# EAGLE design main (EAGLE 9.4.2)
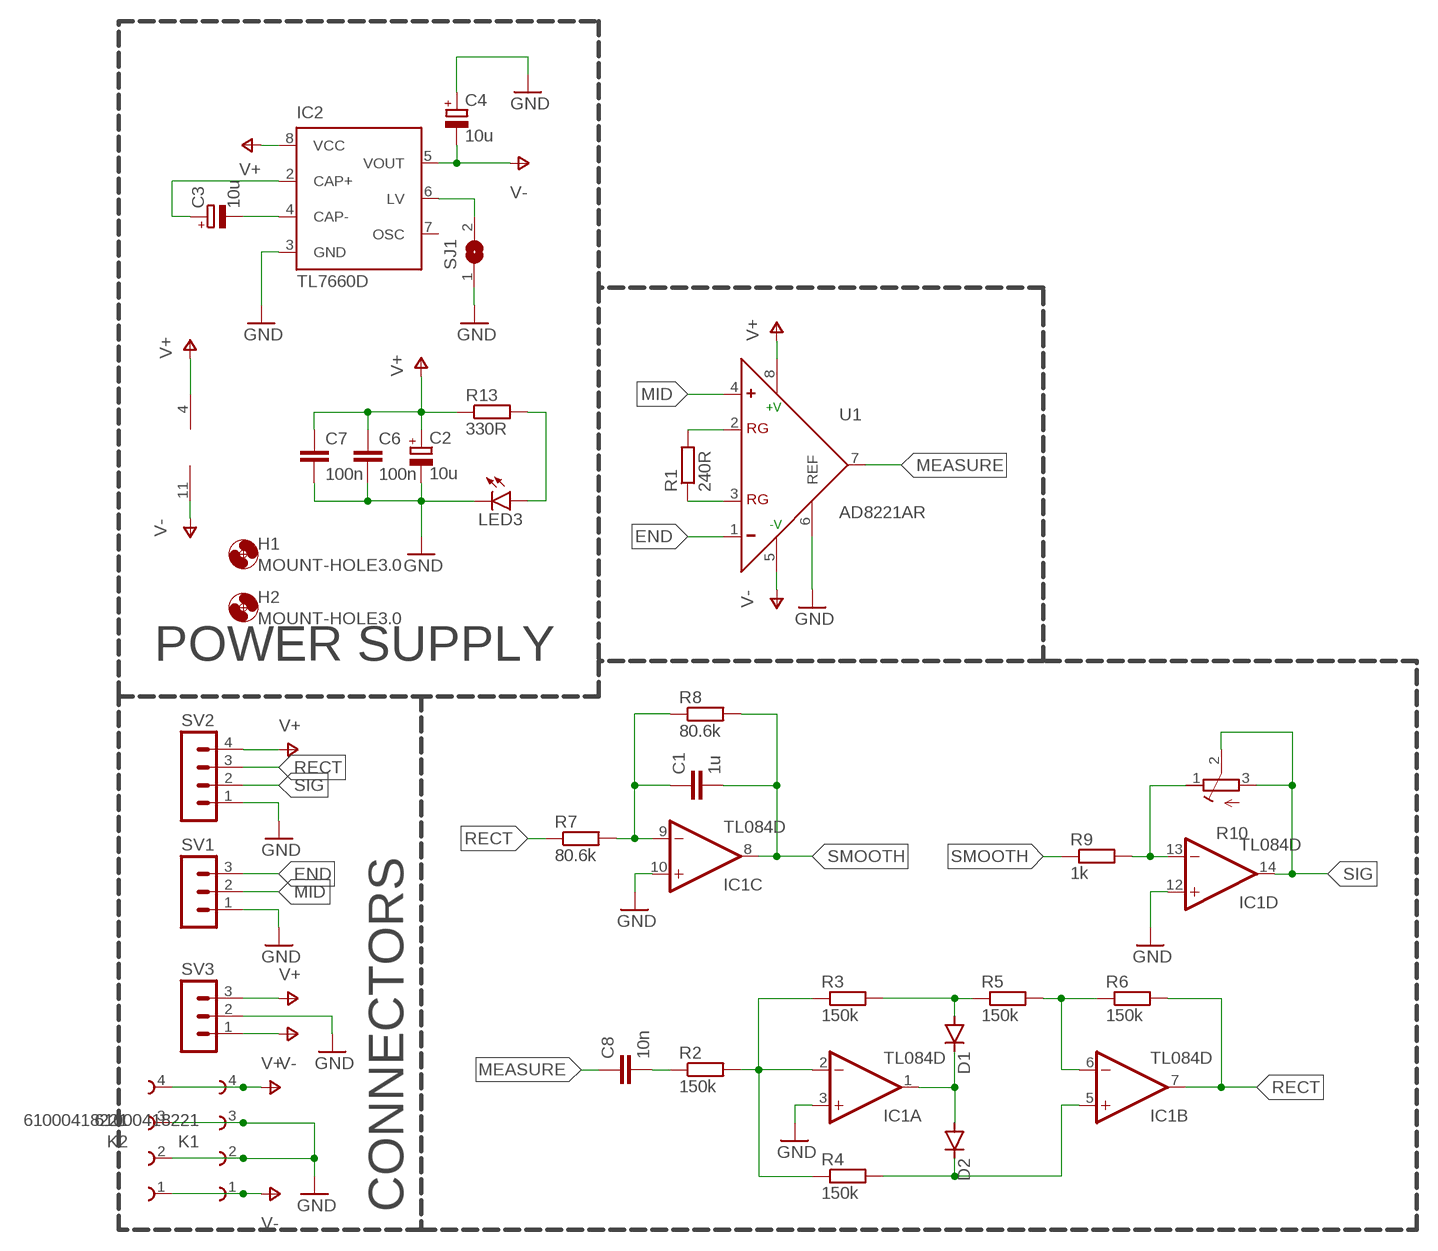
[diagram p0: schematic, sheet 1]

## Parts
C1  1u  C-EUC0805  [C0805]
C2  10u  CPOL-EUSMCB  [SMC_B]
C3  10u  CPOL-EUSMCB  [SMC_B]
C4  10u  CPOL-EUSMCB  [SMC_B]
C6  100n  C-EUC0805  [C0805]
C7  100n  C-EUC0805  [C0805]
C8  10n  C-EUC0805  [C0805]
D1  DIODE-SOD80C  [SOD80C]
D2  DIODE-SOD80C  [SOD80C]
H1  MOUNT-HOLE3.0  [3,0]
H2  MOUNT-HOLE3.0  [3,0]
IC1  TL084D  [SO14]
IC2  TL7660D  [D_R-PDSO-G08]
K1  61000418221  [61000418221]
K2  61000418221  [61000418221]
LED3  LEDCHIP-LED0805  [CHIP-LED0805]
R1  240R  R-EU_R1206  [R1206]
R2  150k  R-EU_R1206  [R1206]
R3  150k  R-EU_R1206  [R1206]
R4  150k  R-EU_R1206  [R1206]
R5  150k  R-EU_R1206  [R1206]
R6  150k  R-EU_R1206  [R1206]
R7  80.6k  R-EU_R1206  [R1206]
R8  80.6k  R-EU_R1206  [R1206]
R9  1k  R-EU_R1206  [R1206]
R10  R-TRIMM3314J  [RTRIM3314J]
R13  330R  R-EU_R1206  [R1206]
SJ1  SJ  [SJ]
SV1  MA03-1  [MA03-1]
SV2  MA04-1  [MA04-1]
SV3  MA03-1  [MA03-1]
U1  AD8221AR  [SO8]

## Nets
END: SV1.3 U1.1(-)
GND: C2.- C4.+ C6.2 C7.2 IC1.3(A:+IN) IC1.10(C:+IN) IC1.12(D:+IN) IC2.3(GND) K1.2 K1.3 K2.2 K2.3 LED3.C SJ1.1 SV1.1 SV2.1 SV3.2 U1.6(REF)
MEASURE: C8.1 U1.7(OUT)
MID: SV1.2 U1.4(+)
N$1: IC1.2(A:-IN) R2.2 R3.1 R4.1
N$2: C8.2 R2.1
N$3: D1.C D2.A IC1.1(A:OUT)
N$4: R1.2 U1.2(RG)
N$5: R1.1 U1.3(RG)
N$6: D1.A R3.2 R5.1
N$7: D2.C IC1.5(B:+IN) R4.2
N$8: IC1.6(B:-IN) R5.2 R6.1
N$9: C1.1 IC1.9(C:-IN) R7.2 R8.1
N$10: IC2.6(LV) SJ1.2
N$11: IC1.13(D:-IN) R9.2 R10.1(E)
N$13: C3.+ IC2.2(CAP+)
N$14: C3.- IC2.4(CAP-)
N$19: LED3.A R13.2
RECT: IC1.7(B:OUT) R6.2 R7.1 SV2.3
SIG: IC1.14(D:OUT) R10.2(S) R10.3(A) SV2.2
SMOOTH: C1.2 IC1.8(C:OUT) R8.2 R9.1
V+: C2.+ C6.1 C7.1 IC1.4(P:V+) IC2.8(VCC) K1.4 K2.4 R13.1 SV2.4 SV3.3 U1.8(+V)
V-: C4.- IC1.11(P:V-) IC2.5(VOUT) K1.1 K2.1 SV3.1 U1.5(-V)
Unconnected: IC2.7(OSC)

## Notes on the sheet
- POWER SUPPLY
- CONNECTORS

## Library data of the parts
C1 C6-C8 = rcl:C-EU: CAPACITOR, European symbol; SPICEPREFIX: C
C2-C4 = rcl:CPOL-EU: POLARIZED CAPACITOR, European symbol; SPICEPREFIX: C
D1 D2 = diode:DIODE-: DIODE
H1 H2 = holes:MOUNT-HOLE: MOUNTING HOLE with drill center marker
IC1 = linear:TL084: OP AMP
IC2 = texas:TL7660: CMOS VOLTAGE CONVERTER Source: http://focus.ti.com/lit/ds/scas794/scas794.pdf; MPN: TL7660CD; OC_FARNELL: 1755282; OC_NEWARK: 14M2439
K1 K2 = Wurth_Elektronik_Electromechanic_Board_to_Board_Connectors_rev15c:61000418221: WR-PHD 2.54mm SMT Pin Header, 4 Pins =>Code : Con_BTB_PHD_2.54_1_SMT_61000418221 <http://katalog.we-online.de/media/images/eican/Con_BTB_PHD_2.54_1_SMT_6100xx18221_pf2.jpg> Details see: http://katalog.we-online.de/en/em/610_0xx_182_21 Created 2014-05-29, Karrer Zheng 2014 (C) Würth Elektronik
LED3 = led:LED: LED OSRAM: - CHIPLED LG R971, LG N971, LY N971, LG Q971, LY Q971, LO R971, LY R971 LH N974, LH R974 LS Q976, LO Q976, LY Q976 LO Q996 - Hyper CHIPLED LW Q18S LB Q993, LB Q99A, LB R99A - SideLED LS A670, LO A670, LY A670, LG A670, LP A670 LB A673, LV A673, LT A673, LW A673 LH A674 LY A675 LS A676, LA A676, LO A676, LY A676, LW A676 LS A679, LY A679, LG A679 - Hyper Micro SIDELED® LS Y876, LA Y876, LO Y876, LY Y876 LT Y87S - SmartLED LW L88C, LW L88S LB L89C, LB L89S, LG L890 LS L89K, LO L89K, LY L89K LS L896, LA L896, LO L896, LY L896 - TOPLED LS T670, LO T670, LY T670, LG T670, LP T670 LSG T670, LSP T670, LSY T670, LOP T670, LYG T670 LG T671, LOG T671, LSG T671 LB T673, LV T673, LT T673, LW T673 LH T674 LS T676, LA T676, LO T676, LY T676, LB T676, LH T676, LSB T676, LW T676 LB T67C, LV T67C, LT T67C, LS T67K, LO T67K, LY T67K, LW E67C LS E67B, LA E67B, LO E67B, LY E67B, LB E67C, LV E67C, LT E67C LW T67C LS T679, LY T679, LG T679 LS T770, LO T770, LY T770, LG T770, LP T770 LB T773, LV T773, LT T773, LW T773 LH T774 LS E675, LA E675, LY E675, LS T675 LS T776, LA T776, LO T776, LY T776, LB T776 LHGB T686 LT T68C, LB T68C - Hyper Mini TOPLED® LB M676 - Mini TOPLED Santana® LG M470 LS M47K, LO M47K, LY M47K Source: http://www.osram.convergy.de LUXEON: - LUMILED® LXK2-PW12-R00, LXK2-PW12-S00, LXK2-PW14-U00, LXK2-PW14-V00 LXK2-PM12-R00, LXK2-PM12-S00, LXK2-PM14-U00 LXK2-PE12-Q00, LXK2-PE12-R00, LXK2-PE12-S00, LXK2-PE14-T00, LXK2-PE14-U00 LXK2-PB12-K00, LXK2-PB12-L00, LXK2-PB12-M00, LXK2-PB14-N00, LXK2-PB14-P00, LXK2-PB14-Q00 LXK2-PR12-L00, LXK2-PR12-M00, LXK2-PR14-Q00, LXK2-PR14-R00 LXK2-PD12-Q00, LXK2-PD12-R00, LXK2-PD12-S00 LXK2-PH12-R00, LXK2-PH12-S00 LXK2-PL12-P00, LXK2-PL12-Q00, LXK2-PL12-R00 Source: www.luxeon.com KINGBRIGHT: KA-3528ASYC Source: www.kingbright.com
R1-R9 R13 = rcl:R-EU_: RESISTOR, European symbol; SPICEPREFIX: R
R10 = rcl:R-TRIMM: Trimm resistor; SPICEMODEL: X; SPICEPREFIXL: POT
SJ1 = jumper:SJ: SMD solder JUMPER
SV1 SV3 = con-lstb:MA03-1: PIN HEADER; OC_FARNELL: unknown; OC_NEWARK: unknown
SV2 = con-lstb:MA04-1: PIN HEADER; OC_FARNELL: unknown; OC_NEWARK: unknown
U1 = kblom:AD8221: Precision Instrumentation Amplifier Applications: Weigh scales Industrial process controls Bridge amplifiers Precision data acquisition systems Medical instrumentation Strain gages Transducer interfaces source <http://www.analog.com/static/imported-files/data_sheets/AD8221.pdf> inamp

## Board
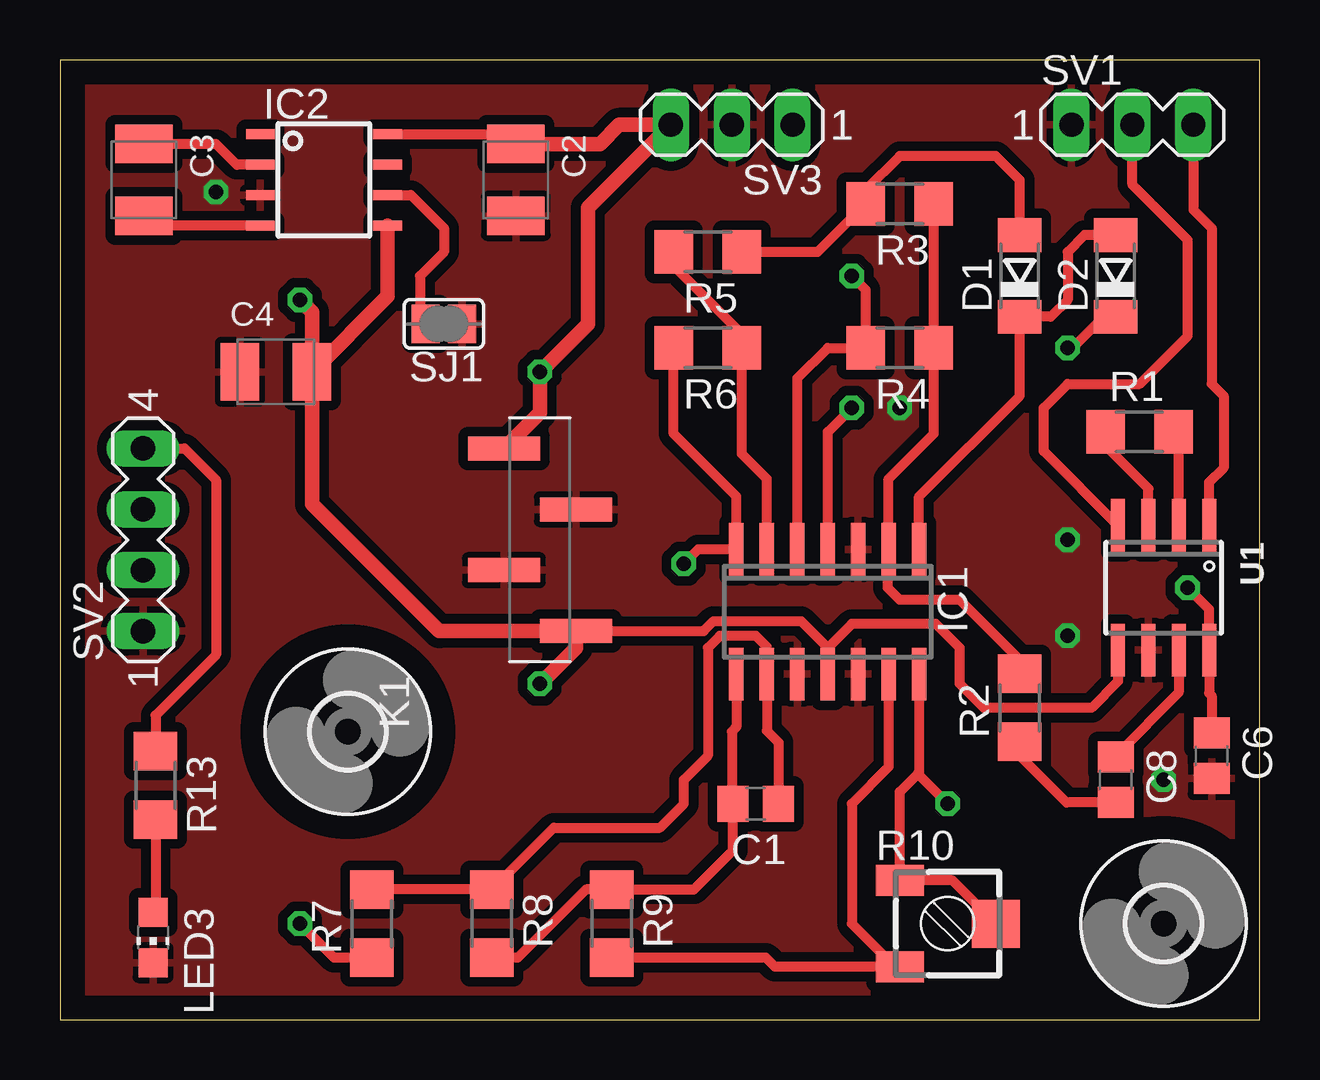
[diagram p1: board, top side]
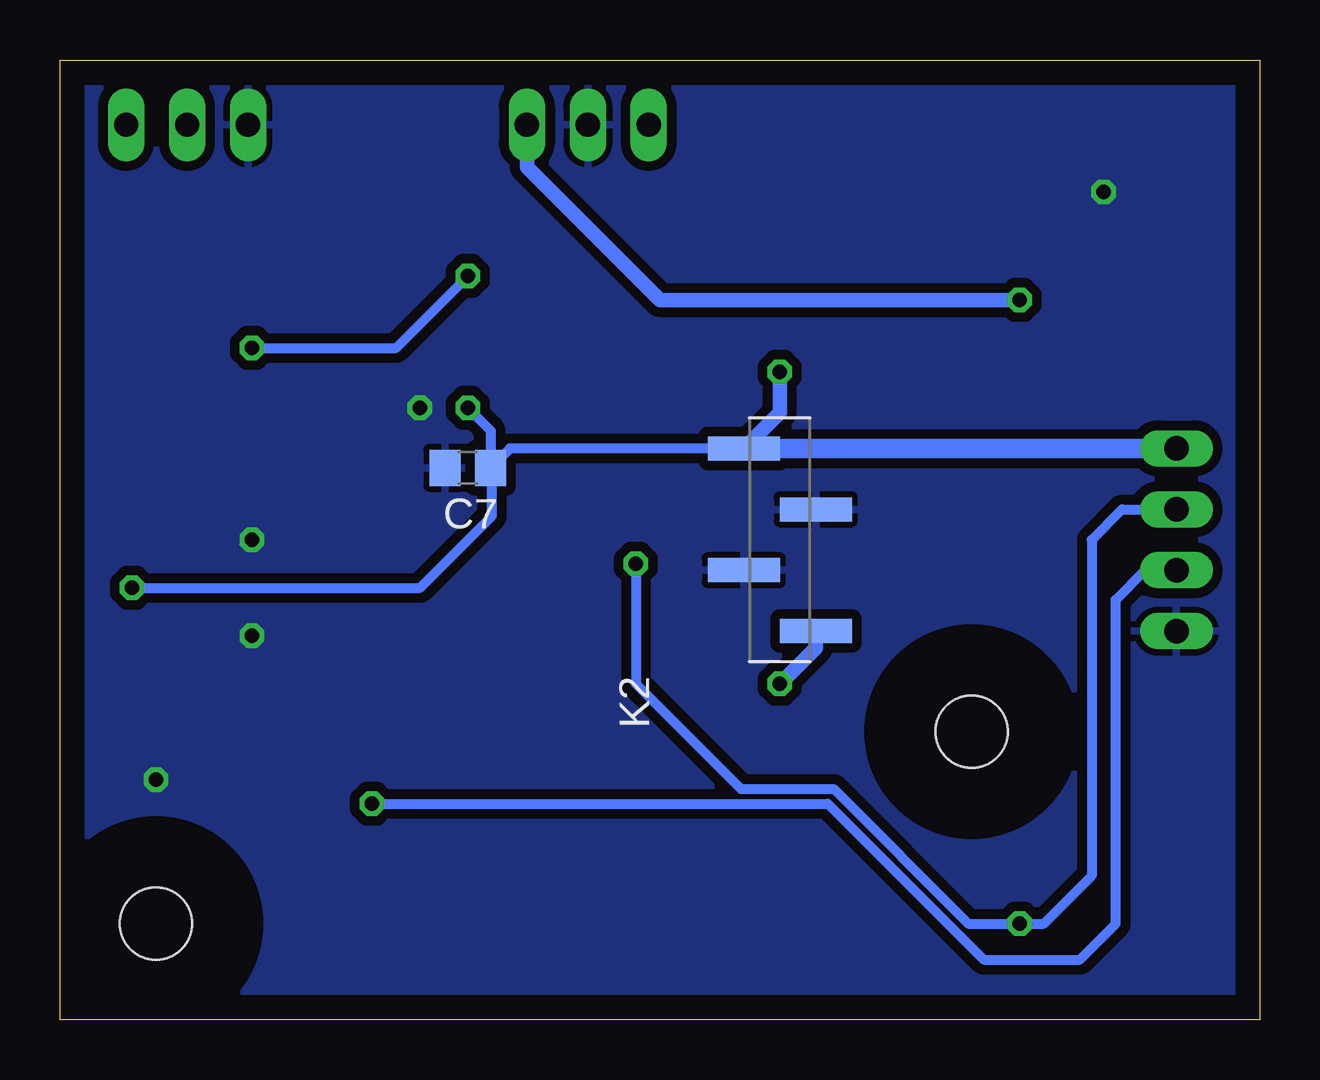
[diagram p2: board, bottom side, seen from below]

Size 50 x 40 mm. Coordinates in mm from the lower left corner, seen from the top.
Outline: 0,0 50,0 50,40 0,40 0,0
Copper layers (1*16): Top 0.035mm / dielectric 1.5mm / Bottom 0.035mm
Design rules "default *": minimum track width 6mil, minimum drill 0.35mm, track to track 8mil, track to pad 8mil, pad to pad 8mil, via to via 8mil, smd to smd 6mil, copper to edge 40mil, drill to drill 6mil, minimum pad ring 10mil, minimum via ring 8mil, stop-mask expansion 4mil, vias tented up to drill 0mil, thermal gap 10mil

### Footprints (pad centres in the part's own frame; a part is rotated, then mirrored left to right if it is on the bottom)
C0805 = smd 1.3 x 1.5: 1 -0.95,0; 2 0.95,0
SMC_B = smd 1.6 x 2.4: + -1.5,0; - 1.5,0
SOD80C = smd 1.4 x 1.8: A 1.7,0; C -1.7,0
3,0 = hole 3: 0,0
SO14 = smd 0.6 x 2.2: 1 -3.81,-2.6; 2 -2.54,-2.6; 3 -1.27,-2.6; 4 0,-2.6; 5 1.27,-2.6; 6 2.54,-2.6; 7 3.81,-2.6; 8 3.81,2.6; 9 2.54,2.6; 10 1.27,2.6; 11 0,2.6; 12 -1.27,2.6; 13 -2.54,2.6; 14 -3.81,2.6
D_R-PDSO-G08 = smd 0.4 x 1.2: 1 -1.905,-2.65; 2 -0.635,-2.65; 3 0.635,-2.65; 4 1.905,-2.65; 5 1.905,2.65; 6 0.635,2.65; 7 -0.635,2.65; 8 -1.905,2.65
61000418221 = smd 1 x 3: 1 -3.81,-1.5; 2 -1.27,1.5; 3 1.27,-1.5; 4 3.81,1.5
CHIP-LED0805 = smd 1.2 x 1.2: A 0,-1.05; C 0,1.05
R1206 = smd 1.6 x 1.803: 1 -1.422,0; 2 1.422,0
RTRIM3314J = smd 1.3 x 2: 1 1.8,-2; 3 -1.8,-2 | smd 2 x 2: 2 0,2
SJ = smd 1.168 x 1.6: 1 -0.762,0; 2 0.762,0
MA03-1 = drill 1.016 long: 1 -2.54,0; 2 0,0; 3 2.54,0
MA04-1 = drill 1.016 long: 1 -3.81,0; 2 -1.27,0; 3 1.27,0; 4 3.81,0
SO8 = smd 0.6 x 2.2: 1 -1.905,-2.6; 2 -0.635,-2.6; 3 0.635,-2.6; 4 1.905,-2.6; 5 1.905,2.6; 6 0.635,2.6; 7 -0.635,2.6; 8 -1.905,2.6

### Placement (x,y rotation side)
C1  29,9 180 top
C2  19,35 270 top
C3  3.5,35 270 top
C4  9,27 0 top
C6  48,11 270 top
C7  33,23 180 bottom
C8  44,10 270 top
D1  40,31 90 top
D2  44,31 90 top
H1  46,4 0 top
H2  12,12 0 top
IC1  32,17 180 top
IC2  11,35 270 top
K1  20,20 90 top
K2  20,20 90 bottom
LED3  3.88,3.42 180 top
R1  45,24.5 0 top
R2  40,13 90 top
R3  35,34 180 top
R4  35,28 180 top
R5  27,32 180 top
R6  27,28 180 top
R7  13,4 90 top
R8  18,4 270 top
R9  23,4 270 top
R10  37,4 270 top
R13  3.98,9.76 270 top
SJ1  16,29 180 top
SV1  44.7,37.3 0 top
SV2  3.46,20 90 top
SV3  28,37.3 180 top
U1  46,18 180 top

### Tracks (layer width: path | path; a pad name or v marks a point on that pad's centre or on a via)
END
  Top 0.406: U1.1 47.91,22.41 48.5,23 48.5,26 48,26.5 48,33 47.24,33.76 SV1.3
GND  (via drill 0.6)
  other vias: 35,25.5 6.5,34.5 42,20 42,16 46,10
  pour Top (isolate 0.406): 0,40 50,40 50,0 0,0
  pour Bottom (isolate 0.406): 0,40 50,40 50,0 0,0
MEASURE
  Top 0.406: U1.7 46.63,13.63 44,11 C8.1
MID
  Top 0.406: U1.4 41,23.7 41,25.5 42,26.5 45,26.5 47,28.5 47,32.5 44.7,34.8 SV1.2
N$1
  Top 0.406: R3.1 R4.1 36.42,24.42 34.54,22.54 IC1.2 34.5,19.56 34.5,18 35,17.5 37.5,17.5 40,15 R2.2
N$2
  Top 0.406: 43.95,9 C8.2 41.95,9.05 40,11 R2.1
N$3
  Top 0.406: IC1.1 35.81,21.81 40,26 D1.C 41.3,29.3 42,30 42,32 42.7,32.7 D2.A
N$4
  Top 0.406: U1.2 46.63,23.79 46.42,24 R1.2
N$5
  Top 0.406: U1.3 45.37,22.14 43.58,23.92 R1.1
N$6
  Top 0.406: R5.1 31.58,32 R3.2 33.58,34.58 35,36 39,36 40,35 D1.A
N$7  (via drill 0.6)
  Top 0.406: IC1.5 30.73,26.73 32,28 R4.2 33.58,30.42 v33,31 | D2.C 43.5,29.3 42.2,28 v42,28
  Bottom 0.406: v42,28 36,28 v33,31
N$8
  Top 0.406: IC1.6 29.46,22.54 28.42,23.58 R6.1 28.42,28.58 25.58,31.42 R5.2
N$9
  Top 0.406: R7.2 R8.1 20.58,8 25,8 26,9 26,10 27,11 27,15.5 27.5,16 29,16 29.46,15.54 IC1.9 | C1.1 29.95,11.55 29.46,12.04 IC1.9 | 29.5,14.44 IC1.9
N$10
  Top 0.406: IC2.6 14.63,34.37 16,33 16,32 15,31 15,29.24 SJ1.2
N$11
  Top 0.406: R9.2 29.42,2.58 29.8,2.2 R10.1 34.8,2.2 33,4 33,9 34.54,10.54 IC1.13
N$13
  Top 0.406: IC2.2 7.37,35.63 6.5,36.5 C3.+
N$14
  Top 0.406: IC2.4 3.9,33.09 C3.-
N$19
  Top 0.406: R13.2 3.98,4.57 LED3.A
RECT  (via drill 0.6)
  Top 0.406: R6.2 25.58,24.42 28.19,21.81 IC1.7 26.6,19.6 v26,19 | R7.1 11.42,2.58 v10,4
  Bottom 0.406: SV2.3 5.73,21.27 7,20 7,6 9,4 v10,4 12.14,4 17.75,9.61 21.61,9.61 26,14 v26,19
SIG  (via drill 0.6)
  Top 0.406: R10.2 37.2,5.8 R10.3 35,9.5 35.75,10.25 | IC1.14 35.81,10.31 35.75,10.25 | 35.75,10.25 v37,9
  Bottom 0.406: v37,9 18,9 11.5,2.5 7.5,2.5 6,4 6,17.5 4.77,18.73 SV2.2
SMOOTH
  Top 0.406: IC1.8 28.19,12.19 28,12 28,9.05 C1.2 28.05,7.05 26.42,5.42 R9.1 21.92,5.42 19.08,2.58 R8.2
V+  (via drill 0.6)
  Top 0.406: IC2.8 18.59,36.91 C2.+ | IC1.4 32,24.5 v33,25.5 | v47,18 47.91,17.09 U1.8 47.91,13.6 48,13.5 C6.1 | SV2.4 5.19,23.81 6.5,22.5 6.5,15.2 3.98,12.68 R13.1
  Top 0.61: K1.4 20,25.31 v20,27 22,29 22,33.84 SV3.3 23.3,37.3 22.5,36.5 C2.+
  Bottom 0.406: K2.4 31.24,23.81 C7.1 | v33,25.5 32.05,24.55 C7.1 | v47,18 35,18 32,21 32,22.95 C7.1
  Bottom 0.61: K2.4 20,25.31 v20,27
  Bottom 0.813: K2.4 SV2.4
V-  (via drill 0.6)
  Top 0.406: U1.5 44.09,14.1 43,13 38.5,13 37.5,14 37.5,15.5 36.5,16.5 33,16.5 32,15.5 | 32,15.5 IC1.11 | K1.1 26.83,16.19 27.25,16.61 30.89,16.61 32,15.5
  Top 0.61: v20,14 21.5,15.5 K1.1 15.81,16.19 10.5,21.5 C4.- | IC2.5 13.65,30.15 C4.- | C4.- 10.5,29.5 v10,30
  Bottom 0.61: SV3.1 30.54,35.54 25,30 v10,30 | v20,14 18.5,15.5 K2.1